# Altium project BufferOutputCard.PrjPcb
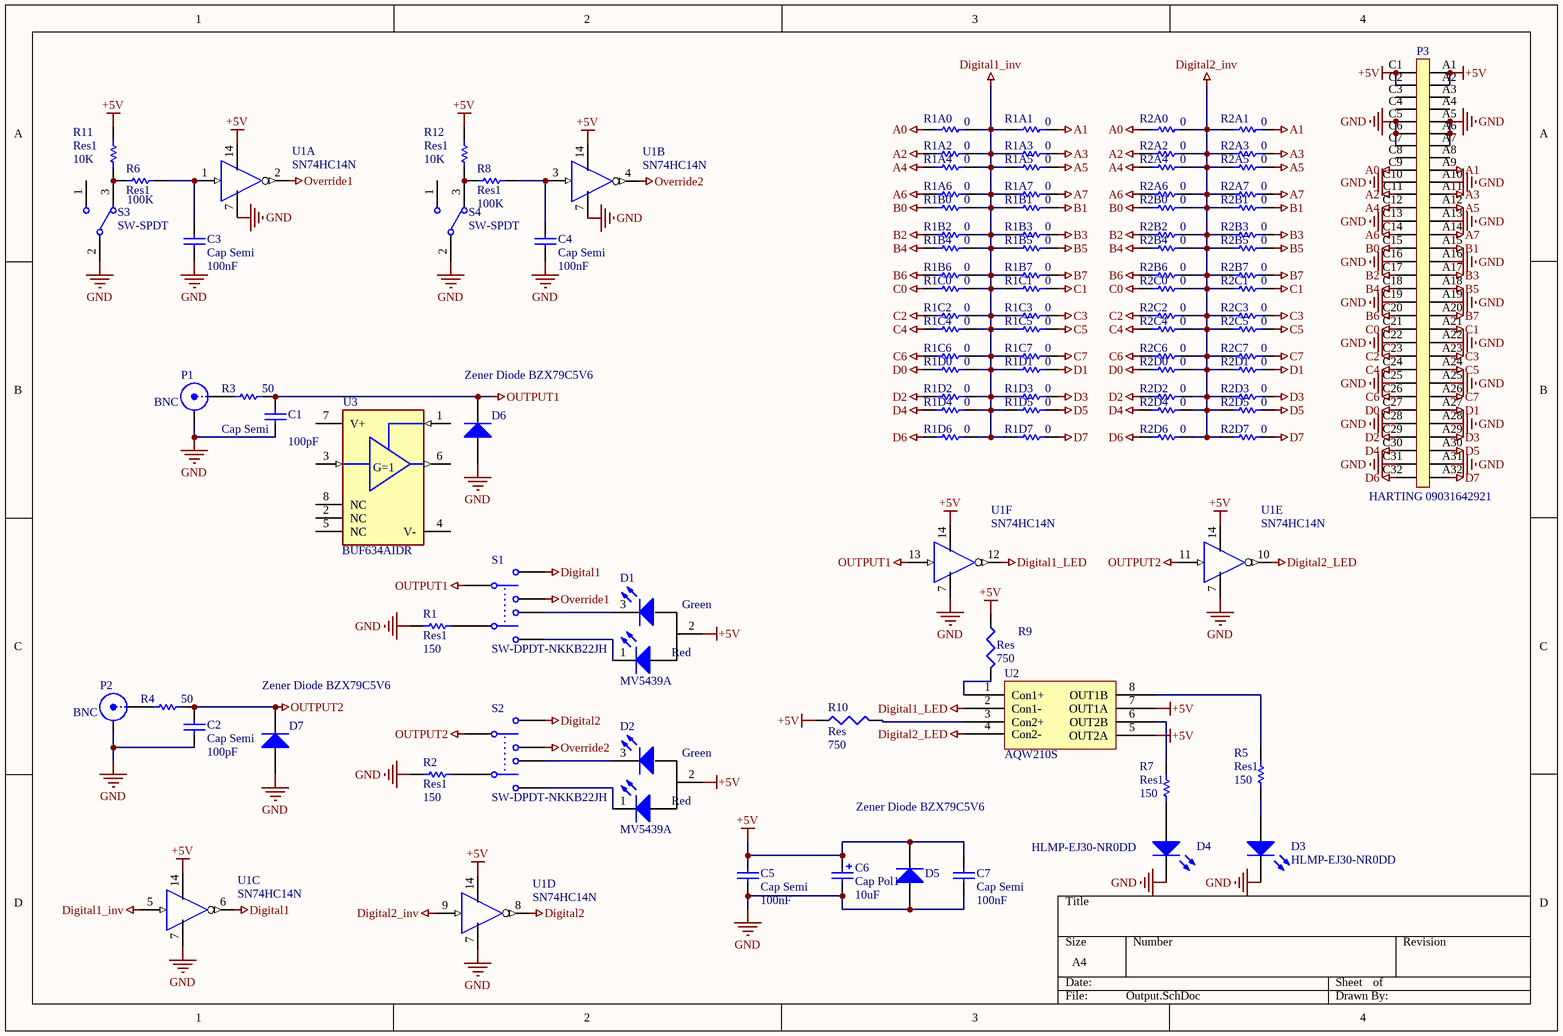
[diagram p0: Output.SchDoc]
1 sheet, 100 parts. Net scope: global (net labels, ports and power ports of the same name join across sheets).
Board file: Output.PcbDoc

## Sheet Output.SchDoc
size A4

### Parts
C1  Cap Semi  value 100pF  [C1206]
C2  Cap Semi  value 100pF  [C1206]
C3  Cap Semi  value 100nF  [C1206]
C4  Cap Semi  value 100nF  [C1206]
C5  Cap Semi  value 100nF  [C1206]
C6  Cap Pol1  value 10uF  [Captantalum]
C7  Cap Semi  value 100nF  [C1206]
D1  MV5439A  [Double LED]
D2  MV5439A  [Double LED]
D3  HLMP-EJ30-NR0DD  [LED-A]
D4  HLMP-EJ30-NR0DD  [LED-A]
D5  Zener Diode BZX79C5V6  [DO-35]
D6  Zener Diode BZX79C5V6  [DO-35]
D7  Zener Diode BZX79C5V6  [DO-35]
P1  BNC  [BNC_RA CON]
P2  BNC  [BNC_RA CON]
P3  HARTING 09031642921  [EURO2.54-2H64-NH]
R1  Res1  value 150  [AXIAL-0.4]
R1A0  value 0  [C1206]  (hidden comment: Res1)
R1A1  value 0  [C1206]  (hidden comment: Res1)
R1A2  value 0  [C1206]  (hidden comment: Res1)
R1A3  value 0  [C1206]  (hidden comment: Res1)
R1A4  value 0  [C1206]  (hidden comment: Res1)
R1A5  value 0  [C1206]  (hidden comment: Res1)
R1A6  value 0  [C1206]  (hidden comment: Res1)
R1A7  value 0  [C1206]  (hidden comment: Res1)
R1B0  value 0  [C1206]  (hidden comment: Res1)
R1B1  value 0  [C1206]  (hidden comment: Res1)
R1B2  value 0  [C1206]  (hidden comment: Res1)
R1B3  value 0  [C1206]  (hidden comment: Res1)
R1B4  value 0  [C1206]  (hidden comment: Res1)
R1B5  value 0  [C1206]  (hidden comment: Res1)
R1B6  value 0  [C1206]  (hidden comment: Res1)
R1B7  value 0  [C1206]  (hidden comment: Res1)
R1C0  value 0  [C1206]  (hidden comment: Res1)
R1C1  value 0  [C1206]  (hidden comment: Res1)
R1C2  value 0  [C1206]  (hidden comment: Res1)
R1C3  value 0  [C1206]  (hidden comment: Res1)
R1C4  value 0  [C1206]  (hidden comment: Res1)
R1C5  value 0  [C1206]  (hidden comment: Res1)
R1C6  value 0  [C1206]  (hidden comment: Res1)
R1C7  value 0  [C1206]  (hidden comment: Res1)
R1D0  value 0  [C1206]  (hidden comment: Res1)
R1D1  value 0  [C1206]  (hidden comment: Res1)
R1D2  value 0  [C1206]  (hidden comment: Res1)
R1D3  value 0  [C1206]  (hidden comment: Res1)
R1D4  value 0  [C1206]  (hidden comment: Res1)
R1D5  value 0  [C1206]  (hidden comment: Res1)
R1D6  value 0  [C1206]  (hidden comment: Res1)
R1D7  value 0  [C1206]  (hidden comment: Res1)
R2  Res1  value 150  [AXIAL-0.4]
R2A0  value 0  [C1206]  (hidden comment: Res1)
R2A1  value 0  [C1206]  (hidden comment: Res1)
R2A2  value 0  [C1206]  (hidden comment: Res1)
R2A3  value 0  [C1206]  (hidden comment: Res1)
R2A4  value 0  [C1206]  (hidden comment: Res1)
R2A5  value 0  [C1206]  (hidden comment: Res1)
R2A6  value 0  [C1206]  (hidden comment: Res1)
R2A7  value 0  [C1206]  (hidden comment: Res1)
R2B0  value 0  [C1206]  (hidden comment: Res1)
R2B1  value 0  [C1206]  (hidden comment: Res1)
R2B2  value 0  [C1206]  (hidden comment: Res1)
R2B3  value 0  [C1206]  (hidden comment: Res1)
R2B4  value 0  [C1206]  (hidden comment: Res1)
R2B5  value 0  [C1206]  (hidden comment: Res1)
R2B6  value 0  [C1206]  (hidden comment: Res1)
R2B7  value 0  [C1206]  (hidden comment: Res1)
R2C0  value 0  [C1206]  (hidden comment: Res1)
R2C1  value 0  [C1206]  (hidden comment: Res1)
R2C2  value 0  [C1206]  (hidden comment: Res1)
R2C3  value 0  [C1206]  (hidden comment: Res1)
R2C4  value 0  [C1206]  (hidden comment: Res1)
R2C5  value 0  [C1206]  (hidden comment: Res1)
R2C6  value 0  [C1206]  (hidden comment: Res1)
R2C7  value 0  [C1206]  (hidden comment: Res1)
R2D0  value 0  [C1206]  (hidden comment: Res1)
R2D1  value 0  [C1206]  (hidden comment: Res1)
R2D2  value 0  [C1206]  (hidden comment: Res1)
R2D3  value 0  [C1206]  (hidden comment: Res1)
R2D4  value 0  [C1206]  (hidden comment: Res1)
R2D5  value 0  [C1206]  (hidden comment: Res1)
R2D6  value 0  [C1206]  (hidden comment: Res1)
R2D7  value 0  [C1206]  (hidden comment: Res1)
R3  value 50  [C1206]  (hidden comment: Res1)
R4  value 50  [C1206]  (hidden comment: Res1)
R5  Res1  value 150  [AXIAL-0.4]
R6  Res1  value 100K  [C1206]
R7  Res1  value 150  [AXIAL-0.4]
R8  Res1  value 100K  [C1206]
R9  Res  value 750  [1206]
R10  Res  value 750  [1206]
R11  Res1  value 10K  [C1206]
R12  Res1  value 10K  [C1206]
S1  SW-DPDT-NKKB22JH  [NKK22]
S2  SW-DPDT-NKKB22JH  [NKK22]
S3  SW-SPDT  [NKK12]
S4  SW-SPDT  [NKK12]
U1  SN74HC14N  [N014]  (parts A,B,C,D,E,F of 6)
U2  AQW210S  [SOP8]
U3  BUF634AIDR  [FP-BUF634AIDR-MFG]

### Nets
+5V: C5.2 C6.1 C7.2 D1.2(A) D2.2(A) D5.2(K) P3.A1 P3.A2(C33) P3.C1 P3.C2 R9.1 R10.1 R11.2 R12.2 U1.14(VCC) U2.5(OUT2A) U2.7(OUT1A)
A0: P3.C9 R1A0.1 R2A0.1
A1: P3.A9 R1A1.2 R2A1.2
A2: P3.C11 R1A2.1 R2A2.1
A3: P3.A11 R1A3.2 R2A3.2
A4: P3.C12 R1A4.1 R2A4.1
A5: P3.A12 R1A5.2 R2A5.2
A6: P3.C14 R1A6.1 R2A6.1
A7: P3.A14 R1A7.2 R2A7.2
B0: P3.C15 R1B0.1 R2B0.1
B1: P3.A15 R1B1.2 R2B1.2
B2: P3.C17 R1B2.1 R2B2.1
B3: P3.A17 R1B3.2 R2B3.2
B4: P3.C18 R1B4.1 R2B4.1
B5: P3.A18 R1B5.2 R2B5.2
B6: P3.C20 R1B6.1 R2B6.1
B7: P3.A20 R1B7.2 R2B7.2
C0: P3.C21 R1C0.1 R2C0.1
C1: P3.A21 R1C1.2 R2C1.2
C2: P3.C23 R1C2.1 R2C2.1
C3: P3.A23 R1C3.2 R2C3.2
C4: P3.C24 R1C4.1 R2C4.1
C5: P3.A24 R1C5.2 R2C5.2
C6: P3.C26 R1C6.1 R2C6.1
C7: P3.A26 R1C7.2 R2C7.2
D0: P3.C27 R1D0.1 R2D0.1
D1: P3.A27 R1D1.2 R2D1.2
D2: P3.C29 R1D2.1 R2D2.1
D3: P3.A29 R1D3.2 R2D3.2
D4: P3.C30 R1D4.1 R2D4.1
D5: P3.A30 R1D5.2 R2D5.2
D6: P3.C32 R1D6.1 R2D6.1
D7: P3.A32 R1D7.2 R2D7.2
Digital1: S1.6 U1.6(Y)
Digital1_inv: R1A0.2 R1A1.1 R1A2.2 R1A3.1 R1A4.2 R1A5.1 R1A6.2 R1A7.1 R1B0.2 R1B1.1 R1B2.2 R1B3.1 R1B4.2 R1B5.1 R1B6.2 R1B7.1 R1C0.2 R1C1.1 R1C2.2 R1C3.1 R1C4.2 R1C5.1 R1C6.2 R1C7.1 R1D0.2 R1D1.1 R1D2.2 R1D3.1 R1D4.2 R1D5.1 R1D6.2 R1D7.1 U1.5(A)
Digital1_LED: U1.12(Y) U2.2(Con1-)
Digital2: S2.6 U1.8(Y)
Digital2_inv: R2A0.2 R2A1.1 R2A2.2 R2A3.1 R2A4.2 R2A5.1 R2A6.2 R2A7.1 R2B0.2 R2B1.1 R2B2.2 R2B3.1 R2B4.2 R2B5.1 R2B6.2 R2B7.1 R2C0.2 R2C1.1 R2C2.2 R2C3.1 R2C4.2 R2C5.1 R2C6.2 R2C7.1 R2D0.2 R2D1.1 R2D2.2 R2D3.1 R2D4.2 R2D5.1 R2D6.2 R2D7.1 U1.9(A)
Digital2_LED: U1.10(Y) U2.4(Con2-)
GND: C1.2 C2.2 C3.1 C4.1 C5.1 C6.2 C7.1 D3.2(K) D4.2(K) D5.1(A) D6.1(A) D7.1(A) P1.2(Y) P2.2(Y) P3.A5 P3.A6 P3.A7 P3.A10 P3.A13 P3.A16 P3.A19 P3.A22 P3.A25 P3.A28 P3.A31 P3.C5 P3.C6 P3.C7 P3.C10 P3.C13 P3.C16 P3.C19 P3.C22 P3.C25 P3.C28 P3.C31 R1.1 R2.1 S3.2 S4.2 U1.7(GND)
OUTPUT1: C1.1 D6.2(K) R3.2 S1.4 U1.13(A)
OUTPUT2: C2.1 D7.2(K) R4.2 S2.4 U1.11(A)
Override1: S1.5 U1.2(Y)
Override2: S2.5 U1.4(Y)
NetC3_2: C3.2 R6.2 U1.1(A)
NetC4_2: C4.2 R8.2 U1.3(A)
NetD1_1: D1.1(RED) S1.2
NetD1_3: D1.3(K) S1.3
NetD2_1: D2.1(RED) S2.2
NetD2_3: D2.3(K) S2.3
NetD3_1: D3.1(A) R5.1
NetD4_1: D4.1(A) R7.1
NetP1_1: P1.1(X) R3.1
NetP2_1: P2.1(X) R4.1
NetR1_2: R1.2 S1.1
NetR2_2: R2.2 S2.1
NetR5_2: R5.2 U2.8(OUT1B)
NetR6_1: R6.1 R11.1 S3.3
NetR7_2: R7.2 U2.6(OUT2B)
NetR8_1: R8.1 R12.1 S4.3
NetR9_2: R9.2 U2.1(Con1+)
NetR10_2: R10.2 U2.3(Con2+)

Not connected (* = marked no-connect by the designer): P3 A3(C34) A4 A8 C3(3) C4(4) C8(8); S3 1; S4 1; U3 1(BW) 2(NC) 3(VIN) 4(V-) 5(NC) 6(VO) 7(V+) 8(NC)

### Notes on the sheet
- (in symbol CMP-04895-000048-1) G=1
- (in symbol Double LED) Green; Red

### Library data of the parts
C1-C5 C7 = Cap Semi: Capacitor (Semiconductor SIM Model); Published: 8-Jun-2000; LatestRevisionDate: 29-May-2009; LatestRevisionNote: IPC-7351 Footprint Added.; PackageReference: C1206; Publisher: Altium Limited; PackageDescription: Chip Capacitor
C6 = Cap Pol1: Polarized Capacitor (Radial); Published: 8-Jun-2000; LatestRevisionDate: 17-Jul-2002; LatestRevisionNote: Re-released for DXP Platform.; PackageReference: RB7.6-15; Publisher: Altium Limited; PackageDescription: Polarized Capacitor (Radial); 2 Leads
D1 D2 = Double LED: Published: 8-Jun-2000; LatestRevisionDate: 08-Jul-2005; LatestRevisionNote: Mech Layer 1 removed.; PackageReference: LED-0; Publisher: Altium Limited; PackageDescription: LED; 2 Leads
D3 D4 = LED0: LED; Published: 8-Jun-2000; LatestRevisionDate: 08-Jul-2005; LatestRevisionNote: Mech Layer 1 removed.; PackageReference: LED-0; Publisher: Altium Limited; PackageDescription: LED; 2 Leads
D5-D7 = Diode 1N914: High Conductance Fast Diode; Published: 8-Jun-2000; LatestRevisionDate: 17-Jul-2002; LatestRevisionNote: Re-released for DXP Platform.; DatasheetVersion: 1997; PackageReference: DO-35; Publisher: Altium Limited; PackageDescription: Diode, Axial; Body 3.8 x 1.9 mm (LxDia. max), Lead Dia. 0.53 mm (max); Code_JEDEC: DO-204-AH; ComponentLink1Description: Manufacturer Link; ComponentLink1URL: http://www.fairchildsemi.com/; ComponentLink2Description: Datasheet; ComponentLink2URL: http://www.fairchildsemi.com/ds/1N%2F1N4448.pdf
P1 P2 = BNC: BNC Vertical Connector; LatestRevisionDate: 17-Jul-2002; LatestRevisionNote: Re-released for DXP Platform.; Publisher: Altium Limited
P3 = Din 41612 64NH: DIN 41612
R1 R1A0-R1A7 R1B0-R1B7 R1C0-R1C7 R1D0-R1D7 R2 R2A0-R2A7 R2B0-R2B7 R2C0-R2C7 R2D0-R2D7 R3-R8 R11 R12 = Res1: Resistor; Published: 8-Jun-2000; LatestRevisionDate: 17-Jul-2002; LatestRevisionNote: Re-released for DXP Platform.; PackageReference: AXIAL-0.3; Publisher: Altium Limited; PackageDescription: Axial Device, Thru-Hole; 2 Leads; 0.3 in Pin Spacing
R9 R10 = Res_SM: Resistor; Published: 8-Jun-2000; LatestRevisionDate: 29-May-2009; LatestRevisionNote: IPC-7351 Footprint Added.; PackageReference: J1-0603; Publisher: Altium Limited; PackageDescription: Chip Resistor
S1 S2 = SW-DPDT-NKK: Double-Pole, Double-Throw Switch; Published: 24-Mar-1999; LatestRevisionDate: 17-Jul-2002; LatestRevisionNote: Re-released for DXP Platform.; PackageReference: DPDT-6; Publisher: Altium Limited; PackageDescription: Switch; 6 Leads
S3 S4 = SW-SPDT: SPDT Subminiature Toggle Switch, Right Angle Mounting, Vertical Actuation; Published: 24-Mar-1999; LatestRevisionDate: 17-Dec-2003; LatestRevisionNote: Schematic revised, PCB Footprint replaced.; DatasheetVersion: 05-Dec-2000; PackageReference: TL36WW15050; Publisher: Altium Limited; PackageDescription: Switch; 4 Leads; ComponentLink1Description: Manufacturer Link; ComponentLink1URL: http://www.apem.com
U1 = SN74HC14N: Hex Schmitt-Trigger Inverter; Published: 8-Jun-2000; LatestRevisionDate: 04-Mar-2005; LatestRevisionNote: Stylized 3D Model Added.; DatasheetVersion: May-1997; PackageVersion: Oct-1995; PackageReference: N014; Publisher: Altium Limited; PackageDescription: DIP; 14 Leads; Row Spacing 7.62 mm; Pitch 2.54 mm; ComponentLink1Description: Manufacturer Link; ComponentLink1URL: http://www.ti.com/; ComponentLink2Description: Datasheet; ComponentLink2URL: http://www-s.ti.com/sc/ds/sn74hc14.pdf
U2 = AQW210SX
U3 = CMP-04895-000048-1: IC OP AMP BUFFER 8SOIC; Manufacturer: Texas Instruments; Voltage Gain: 0.00099V/mV; Standoff Height: 0.11mm; Min Dual Supply Voltage: 2.25V; Gain Bandwidth: 240MHz; Output Current Per Channel: 250mA; Input Offset Voltage: 36mV; Min Supply Voltage: 4.5V; Number Of Channels: 1; Max Junction Temp: +150°C; Max Supply Voltage: 36V; Bandwidth: 35-210MHz; Input Bias Current: 0.03-0.25uA; Max Dual Supply Voltage: 18V; Description: General Purpose Amplifier 1 Circuit Rail-to-Rail 8-SOIC; Nominal Supply Current: 1.5-8.5mA; Height: 1.75mm; Manufacturer Part Number: BUF634AIDR; Automotive: No; Digikey Description: IC OP AMP BUFFER 8SOIC; Device Class L3: Buffer; ComponentLink2URL: http://www.ti.com/lit/ds/symlink/buf634a.pdf; Category: IC; Device Class L2: Linear ICs; Device Class L1: Integrated Circuits (ICs); Temperature Range Low: -40°C; Package: SOIC8; Temperature: -40°C to +125°C; Temperature Range High: +125°C; Mouser Description: High-Speed Buffer 1 Channel 35MHz to 210MHz 36V 250mA Bipolar 8-Pin SOIC T/R; Octopart: https://octopart.com/buf634aidr-texas+instruments-99505311; RoHS: TRUE; Lead Free: Yes; ComponentLink2Description: Datasheet